# Altium schematic sheet DesChal2.SchDoc
size A
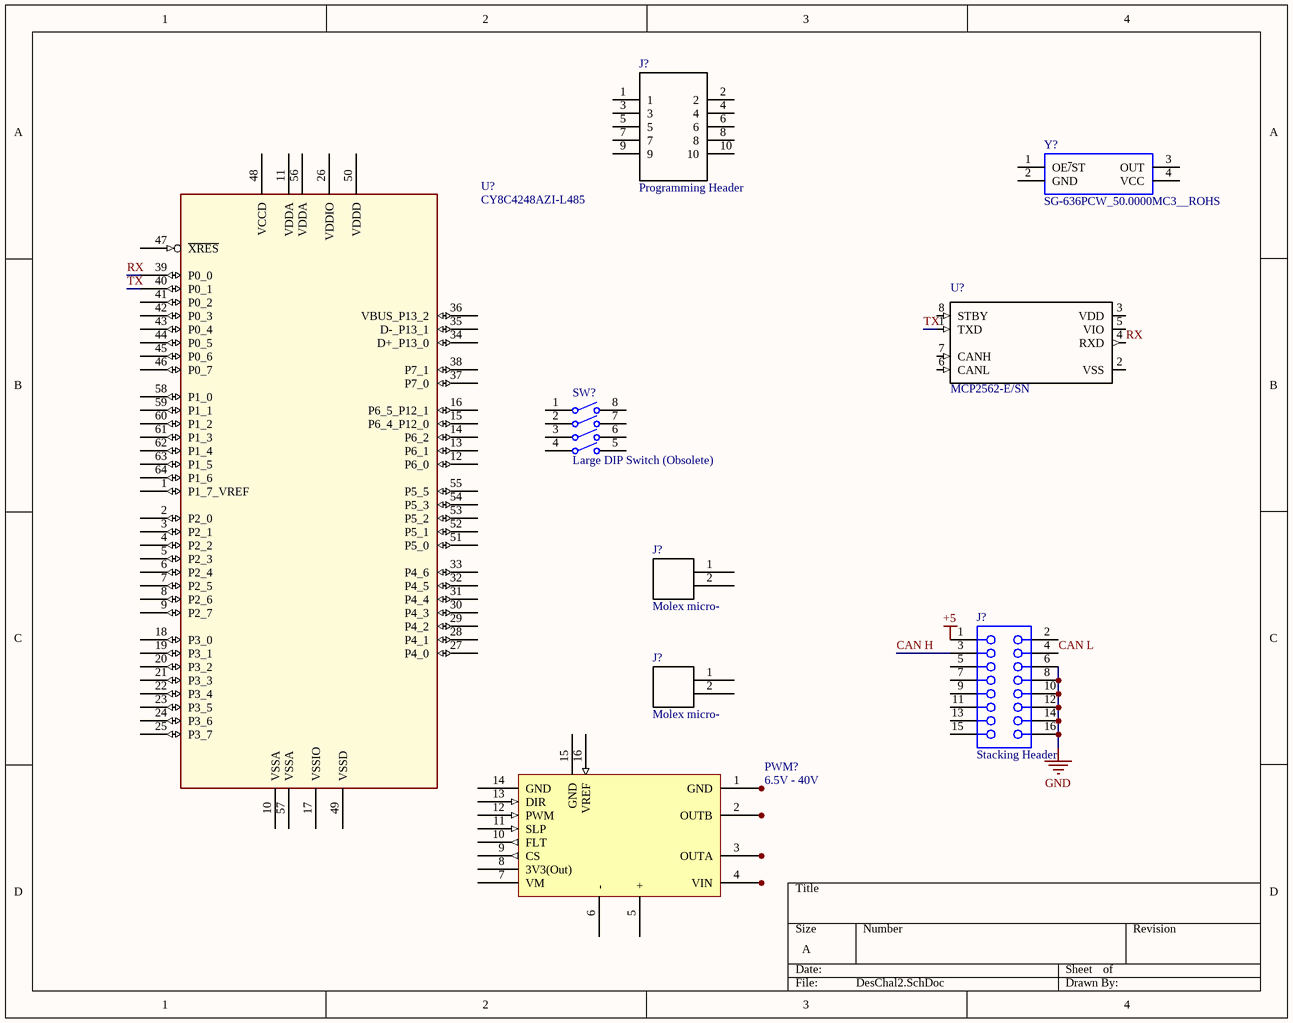
[diagram p0: DesChal2.SchDoc]

## Parts
(Parts that share a designator on the sheet are numbered #1, #2 ... from top to bottom, then left to right.)
J?#1  Programming Header  [programming]
J?#2  Molex micro-  [Microfit 2 pin]
J?#3  Stacking Header  [SMTC-SSQ-108-02-X-D]
J?#4  Molex micro-  [Microfit 2 pin]
PWM?  6.5V - 40V  [Pololu_G2_Driver_24v21]
SW?  Large DIP Switch (Obsolete)  [SOP254P991X385-8N]
U?#1  CY8C4248AZI-L485  [TQFP50P1200X1200X160-64N]
U?#2  MCP2562-E/SN  [SOIC127P600X175-8N]
Y?  SG-636PCW_50.0000MC3__ROHS  [SG-636]

## Nets
+5: J?#3.1
GND: J?#3.6 J?#3.8 J?#3.10 J?#3.12 J?#3.14 J?#3.16
CAN H: J?#3.3
CAN L: J?#3.4
RX: U?#1.39(P0_0) U?#2.4(RXD)
TX: U?#1.40(P0_1) U?#2.1(TXD)
NetPWM?_1: PWM?.1(GND) PWM?.1a(GND) PWM?.1b(GND)
NetPWM?_2: PWM?.2(OUTB) PWM?.2a(OUTB) PWM?.2b(OUTB)
NetPWM?_3: PWM?.3(OUTA) PWM?.3a(OUTA) PWM?.3b(OUTA)
NetPWM?_4: PWM?.4(VIN) PWM?.4a(VIN) PWM?.4b(VIN)

Not connected (* = marked no-connect by the designer): J?#1 1 2 3 4 5 6 7 8 9 10; J?#2 1 2; J?#3 2 5 7 9 11 13 15; J?#4 1 2; PWM? 5(+) 6(-) 7(VM) 8(3V3(Out)) 9(CS) 10(FLT) 11(SLP) 12(PWM) 13(DIR) 14(GND) 15(GND) 16(VREF); SW? 1 2 3 4 5 6 7 8; U?#1 1(P1_7_VREF) 2(P2_0) 3(P2_1) 4(P2_2) 5(P2_3) 6(P2_4) 7(P2_5) 8(P2_6) 9(P2_7) 10(VSSA) 11(VDDA) 12(P6_0) 13(P6_1) 14(P6_2) 15(P6_4_P12_0) 16(P6_5_P12_1) 17(VSSIO) 18(P3_0) 19(P3_1) 20(P3_2) 21(P3_3) 22(P3_4) 23(P3_5) 24(P3_6) 25(P3_7) 26(VDDIO) 27(P4_0) 28(P4_1) 29(P4_2) 30(P4_3) 31(P4_4) 32(P4_5) 33(P4_6) 34(D+_P13_0) 35(D-_P13_1) 36(VBUS_P13_2) 37(P7_0) 38(P7_1) 41(P0_2) 42(P0_3) 43(P0_4) 44(P0_5) 45(P0_6) 46(P0_7) 47(~{XRES}) 48(VCCD) 49(VSSD) 50(VDDD) 51(P5_0) 52(P5_1) 53(P5_2) 54(P5_3) 55(P5_5) 56(VDDA) 57(VSSA) 58(P1_0) 59(P1_1) 60(P1_2) 61(P1_3) 62(P1_4) 63(P1_5) 64(P1_6); U?#2 2(VSS) 3(VDD) 5(VIO) 6(CANL) 7(CANH) 8(STBY); Y? 1(OE~{/}ST) 2(GND) 3(OUT) 4(VCC)

## Library data of the parts
J?#2 J?#4 = Molex micro-fit 2-pin: Molex micro-fit 3.0. Molex P/N 0430450227
J?#3 = Stacking Header: SQ Post Socket, Through-hole, Vertical, -55 to 125 degC, 2.54 mm Pitch, 16-Pin, Female, RoHS; Manufacturer: Samtec; PartNumber: SSQ-108-02-G-D; Pitch: 2.54 mm; ComponentLink2URL: http://www.samtec.com/documents/webfiles/pdf/SSQ_TH.PDF; ComponentLink3Description: Package Specification; Mounting Technology: Through-hole; RoHS: True; PackageReference: SSQ-108-02-X-D; Orientation: Vertical; ComponentLink1URL: http://www.samtec.com; DatasheetVersion: F-214; Temperature Range: -55 to 125 degC; PackageDescription: Assembly, Socket Strip .025[0.64] SQ Tail; PackageVersion: BD, 6/1987; ComponentLink2Description: Datasheet; ComponentLink1Description: Manufacturer URL; ComponentLink3URL: http://www.samtec.com/documents/webfiles/cpdf/SSQ-1XX-XX-XXX-X-XX-XXX-XX-X-MKT.pdf
PWM? = Pololu G2 High-Power Motor Driver 24v21: This discrete MOSFET H-bridge motor driver enables bidirectional control of one high-power DC brushed motor. The small 1.3″ × 0.8″ board supports a wide 6.5 V to 40 V voltage range and is efficient enough to deliver a continuous 21 A without a heat sink. Additional features of this second-generation (G2) driver include reverse-voltage protection along with basic current sensing and current limiting functionality.; ComponentLink1Description: Product Info; ComponentLink1URL: https://www.pololu.com/product/2995/specs
SW? = Large DIP Switch (Obsolete): SOP254P991X385-8N
U?#1 = PSOC MC: 64 pin psoc; Part_Number: CY8C4248AZI-L485
U?#2 = CAN Tranceiver: Microchip MCP2562-E/SN, CAN Transceiver 1MBps 1-channel IEC 61000-4-2, 8-Pin SOIC; Price: None; MF: Microchip; SnapEDA_Link: https://www.snapeda.com/parts/MCP2562-E/SN/Microchip/view-part/?ref=snap; MP: MCP2562-E/SN; Availability: Unavailable; Package: SO-8 Microchip; Value: *
Y? = Oscilator: Standard Clock Oscillators; Manufacturer_Name: Epson Timing; Manufacturer_Part_Number: SG-636PCW 50.0000MC3: ROHS; RS Part Number: *; RS Price/Stock: *; Arrow Part Number: SG-636PCW 50.0000MC3: ROHS; Arrow Price/Stock: *; Datasheet Link: http://www.mouser.com/ds/2/137/G-636PCE_en-1003252.pdf